# EAGLE schematic tba810as stereo (EAGLE 6.4)
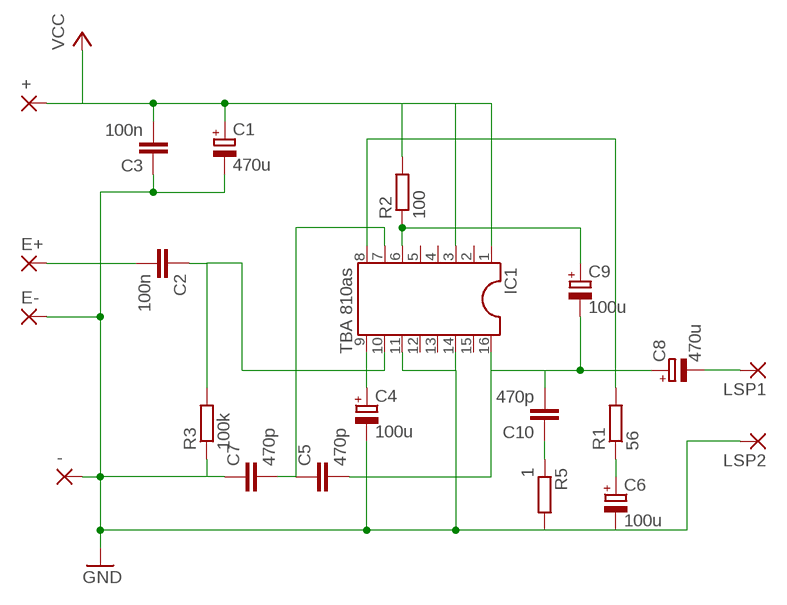
[diagram p0: schematic, sheet 1]

## Parts
+  2,15/1,0  [2,15/1,0]
-  2,15/1,0  [2,15/1,0]
C1  470u  CPOL-EUE5-8.5  [E5-8,5]
C2  100n  C-EU025-024X044  [C025-024X044]
C3  100n  C-EU025-024X044  [C025-024X044]
C4  100u  CPOL-EUE2.5-5  [E2,5-5]
C5  470p  C-EU025-024X044  [C025-024X044]
C6  100u  CPOL-EUE2.5-5  [E2,5-5]
C7  470p  C-EU025-024X044  [C025-024X044]
C8  470u  CPOL-EUE5-8.5  [E5-8,5]
C9  100u  CPOL-EUE2.5-5  [E2,5-5]
C10  470p  C-EU025-024X044  [C025-024X044]
E+  2,15/1,0  [2,15/1,0]
E-  2,15/1,0  [2,15/1,0]
IC1  TBA 810as  DIL16  [DIL16]
LSP1  2,15/1,0  [2,15/1,0]
LSP2  2,15/1,0  [2,15/1,0]
R1  56  R-EU_0207/7  [0207/7]
R2  100  R-EU_0207/7  [0207/7]
R3  100k  R-EU_0207/7  [0207/7]
R5  1  R-EU_0207/7  [0207/7]

## Nets
GND: -.1(P) C1.- C3.1 C4.- C6.- C7.1 E-.1(P) IC1.11 IC1.14 LSP2.1(P) R3.1 R5.2
N$1: C8.- LSP1.1(P)
N$2: C2.1 IC1.10 R3.2
N$3: C10.1 R5.1
N$4: C9.+ IC1.6 R2.1
N$5: C5.1 C7.2 IC1.7
N$7: C5.2 C8.+ C9.- C10.2 IC1.16
N$9: C4.+ IC1.9
N$11: C6.+ R1.1
N$14: C2.2 E+.1(P)
N$16: IC1.8 R1.2
VCC: +.1(P) C1.+ C3.2 IC1.1 IC1.3 R2.2
Unconnected: IC1.2 IC1.4 IC1.5 IC1.12 IC1.13 IC1.15

## Library data of the parts
+ - E+ E- LSP1 LSP2 = wirepad:2,15/1,0: THROUGH-HOLE PAD
C1 C4 C6 C8 C9 = rcl:CPOL-EU: POLARIZED CAPACITOR, European symbol
C2 C3 C5 C7 C10 = rcl:C-EU: CAPACITOR, European symbol
IC1 = ic-package:DIL16: Dual In Line / Socket
R1-R3 R5 = resistor:R-EU_: RESISTOR, European symbol